# Altium project MB1363.PrjPcb (part 3 of 4)

## Sheet Ethernet.SchDoc: Ethernet PHY with RJ45 connector
size A4; Date: Not used; ApprovedBy: Not used; CheckedBy: Not used; Author: Not used; CompanyName: STMicroelectronics; DrawnBy: Not used; Engineer: Not used; Organization: Not used; Address1: Not used; Address2: Not used; Address3: Not used; Address4: Not used; DocumentNumber: 6; Revision: Not used; SheetNumber: 6; SheetTotal: 9; Time: Not used; ImagePath: Not used; Application_BuildNumber: Not used
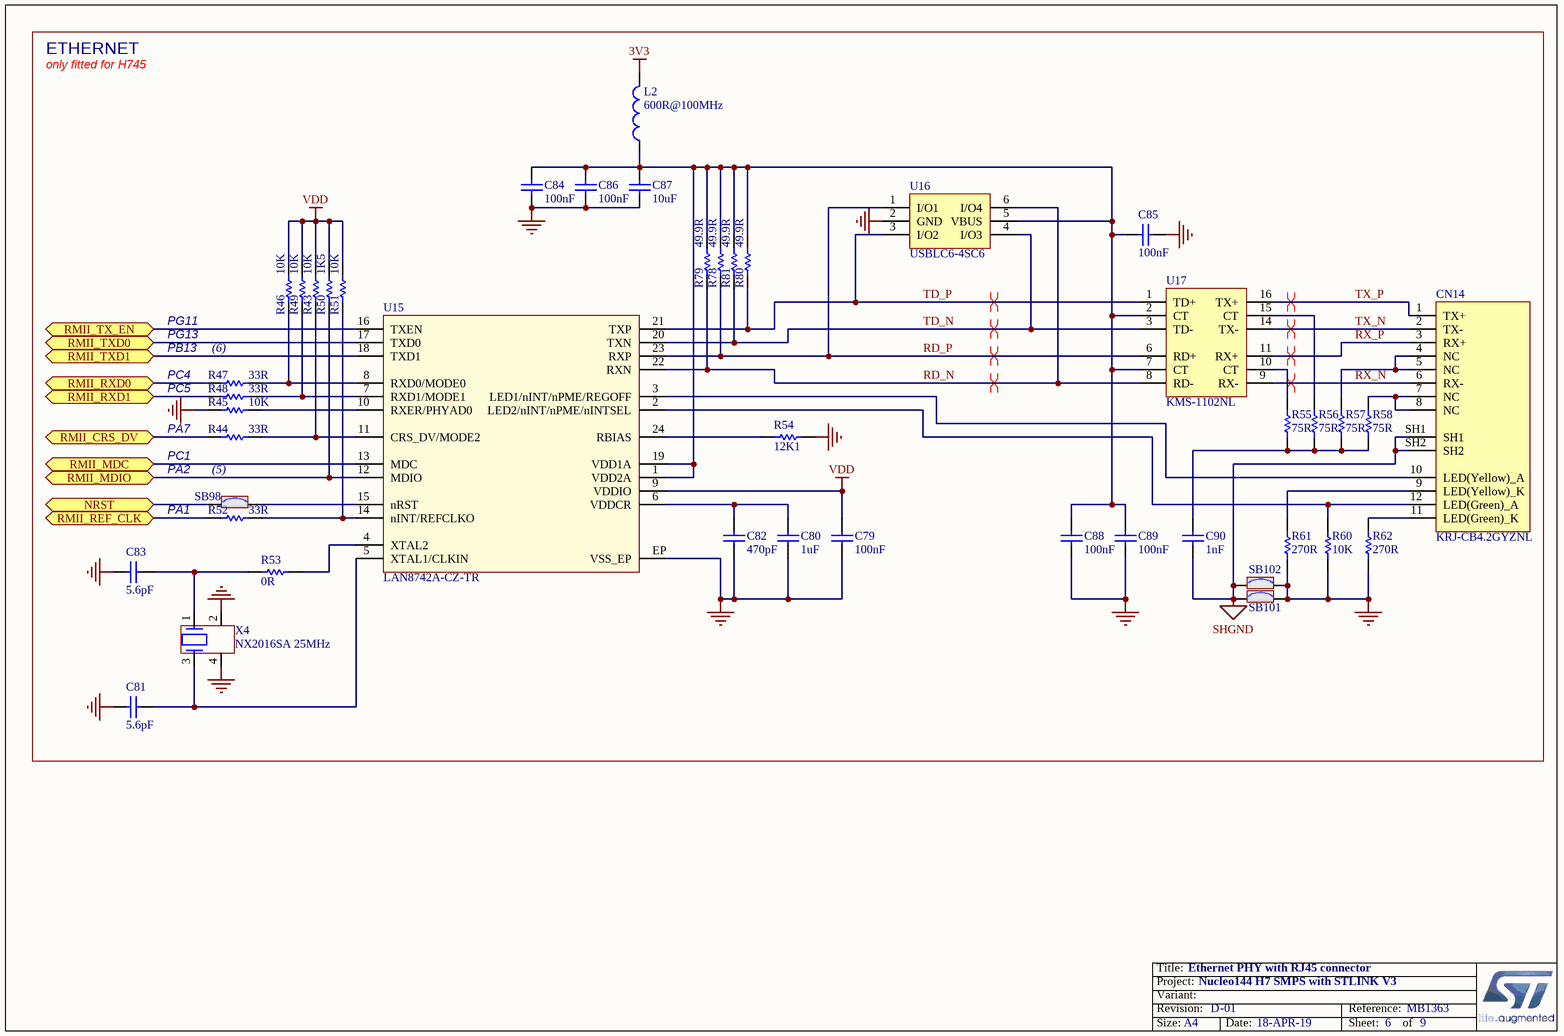
[diagram p7: Ethernet.SchDoc]

### Parts
C79  value 100nF  [C0603]  (hidden comment: Capacitor)
C80  value 1uF  [C0402]  (hidden comment: Capacitor)
C81  value 5.6pF  [C0402]  (hidden comment: Capacitor)
C82  value 470pF  [C0402]  (hidden comment: Capacitor)
C83  value 5.6pF  [C0402]  (hidden comment: Capacitor)
C84  value 100nF  [C0603]  (hidden comment: Capacitor)
C85  value 100nF  [C0603]  (hidden comment: Capacitor)
C86  value 100nF  [C0603]  (hidden comment: Capacitor)
C87  value 10uF  [C0603]  (hidden comment: Capacitor)
C88  value 100nF  [C0603]  (hidden comment: Capacitor)
C89  value 100nF  [C0603]  (hidden comment: Capacitor)
C90  value 1nF  [C1206_H1P6]  (hidden comment: Capacitor)
CN14  value KRJ-CB4.2GYZNL  [CON_RJ45_DGKYD_KRJ-CB4.2GYZNL]  (hidden comment: RJ45_KRJ-CB4.2GYZNL)
L2  value 600R@100MHz  [L0603]  (hidden comment: BEAD)
R43  value 10K  [R0402]  (hidden comment: Resistor)
R44  value 33R  [R0402]  (hidden comment: Resistor)
R45  value 10K  [R0402]  (hidden comment: Resistor)
R46  value 10K  [R0402]  (hidden comment: Resistor)
R47  value 33R  [R0402]  (hidden comment: Resistor)
R48  value 33R  [R0402]  (hidden comment: Resistor)
R49  value 10K  [R0402]  (hidden comment: Resistor)
R50  value 1K5  [R0402]  (hidden comment: Resistor)
R51  value 10K  [R0402]  (hidden comment: Resistor)
R52  value 33R  [R0402]  (hidden comment: Resistor)
R53  value 0R  [R0402]  (hidden comment: Resistor)
R54  value 12K1  [R0402]  (hidden comment: Resistor)
R55  value 75R  [R0402]  (hidden comment: Resistor)
R56  value 75R  [R0402]  (hidden comment: Resistor)
R57  value 75R  [R0402]  (hidden comment: Resistor)
R58  value 75R  [R0402]  (hidden comment: Resistor)
R60  value 10K  [R0402]  (hidden comment: Resistor)
R61  value 270R  [R0402]  (hidden comment: Resistor)
R62  value 270R  [R0402]  (hidden comment: Resistor)
R78  value 49.9R  [R0402]  (hidden comment: Resistor)
R79  value 49.9R  [R0402]  (hidden comment: Resistor)
R80  value 49.9R  [R0402]  (hidden comment: Resistor)
R81  value 49.9R  [R0402]  (hidden comment: Resistor)
SB98  SB_ON  [SOLDER-BRIDGE_R0603-0R]  (value not drawn)
SB101  SB_ON  [SOLDER-BRIDGE_R0603-0R]  (value not drawn)
SB102  SB_ON  [SOLDER-BRIDGE_R0603-0R]  (value not drawn)
U15  LAN8742A-CZ-TR  [ICC_VQFN24-EPAD_4X4_P050]
U16  USBLC6-4SC6  [ESD_SOT23-6L]
U17  KMS-1102NL  [TRS_DGKYD_KMS-1102NL]
X4  value NX2016SA 25MHz  [CRY_NX2016SA_4P]  (hidden comment: XTAL_4_PINS)

### Ports
NRST (bidir), RMII_CRS_DV (bidir), RMII_MDC (bidir), RMII_MDIO (bidir), RMII_REF_CLK (bidir), RMII_RXD0 (bidir), RMII_RXD1 (bidir), RMII_TX_EN (bidir), RMII_TXD0 (bidir), RMII_TXD1 (bidir)

### Nets
3V3: L2.2
GND: C79.1 C80.1 C81.1 C82.1 C83.1 C84.1 C85.2 C86.1 C87.1 C88.1 C89.1 R45.2 R54.2 R60.1 R61.1 R62.1 SB101.2 SB102.2 U15.EP(VSS_EP) U16.2(GND) X4.2 X4.4
SHGND: C90.1 CN14.SH1 CN14.SH2 SB101.1 SB102.1
VDD: C79.2 R43.2 R46.2 R49.2 R50.2 R51.2 U15.9(VDDIO)
NRST: SB98.1 ; port NRST
RD_N: R79.1 U15.22(RXN) U16.6(I/O4) U17.8(RD-)
RD_P: R78.1 U15.23(RXP) U16.1(I/O1) U17.6(RD+)
RMII_CRS_DV: R44.1 ; port RMII_CRS_DV
RMII_MDC: U15.13(MDC) ; port RMII_MDC
RMII_MDIO: R50.1 U15.12(MDIO) ; port RMII_MDIO
RMII_REF_CLK: R52.1 ; port RMII_REF_CLK
RMII_RXD0: R47.1 ; port RMII_RXD0
RMII_RXD1: R48.1 ; port RMII_RXD1
RMII_TX_EN: U15.16(TXEN) ; port RMII_TX_EN
RMII_TXD0: U15.17(TXD0) ; port RMII_TXD0
RMII_TXD1: U15.18(TXD1) ; port RMII_TXD1
RX_N: CN14.6(RX-) U17.9(RX-)
RX_P: CN14.3(RX+) U17.11(RX+)
TD_N: R81.1 U15.20(TXN) U16.4(I/O3) U17.3(TD-)
TD_P: R80.1 U15.21(TXP) U16.3(I/O2) U17.1(TD+)
TX_N: CN14.2(TX-) U17.14(TX-)
TX_P: CN14.1(TX+) U17.16(TX+)
NetC80_2: C80.2 C82.2 U15.6(VDDCR)
NetC81_2: C81.2 U15.5(XTAL1/CLKIN) X4.3
NetC83_2: C83.2 R53.1 X4.1
NetC84_2: C84.2 C85.1 C86.2 C87.2 C88.2 C89.2 L2.1 R78.2 R79.2 R80.2 R81.2 U15.1(VDD2A) U15.19(VDD1A) U16.5(VBUS) U17.2(CT) U17.7(CT)
NetC90_2: C90.2 R55.1 R56.1 R57.1 R58.1
NetCN14_4: CN14.4(NC) CN14.5(NC) R57.2
NetCN14_7: CN14.7(NC) CN14.8(NC) R58.2
NetCN14_9: CN14.9(LED(Yellow)_K) R61.2
NetCN14_10: CN14.10(LED(Yellow)_A) U15.3(LED1/nINT/nPME/REGOFF)
NetCN14_11: CN14.11(LED(Green)_K) R62.2
NetCN14_12: CN14.12(LED(Green)_A) R60.2 U15.2(LED2/nINT/nPME/nINTSEL)
NetR43_1: R43.1 R44.2 U15.11(CRS_DV/MODE2)
NetR45_1: R45.1 U15.10(RXER/PHYAD0)
NetR46_1: R46.1 R47.2 U15.8(RXD0/MODE0)
NetR48_2: R48.2 R49.1 U15.7(RXD1/MODE1)
NetR51_1: R51.1 R52.2 U15.14(nINT/REFCLKO)
NetR53_2: R53.2 U15.4(XTAL2)
NetR54_1: R54.1 U15.24(RBIAS)
NetR55_2: R55.2 U17.10(CT)
NetR56_2: R56.2 U17.15(CT)
NetSB98_2: SB98.2 U15.15(nRST)

### Layout directives
differential pair: RD_N, RD_P, RX_N, RX_P, TD_N, TD_P, TX_N, TX_P

### Notes on the sheet
- ETHERNET
- only fitted for H745
- PG11
- PG13
- PB13
- PC4
- (6)
- PC5
- PA7
- PC1
- PA2
- PA1
- (5)
- Title:
- Project:
- Size:
- Revision:
- Variant:
- A4
- -
- Date:
- Reference:
- Sheet:
- of

### Library data of the parts
C79 C84-C86 C88 C89 = MCD-00237: Capacitor, MLCC, 100nF, 6V3, X5R, 10%, 0603, T=0,8mm; Manufacturer_Part_Number: CC0603KRX5R5BB104; Manufacturer: YAGEO; Provided_By: SUBCO; ECCN_US: EAR99; ECCN_EU: NEC; Internal_Part_Number: MCD-00237; Status: Released; Part_Type: Capacitor; Package: C0603; ComponentLink1Description: Datasheet; ComponentLink1URL: http://tunmcdsvn.tun.st.com/Component_Datasheet_Library/Trunk/Capacitors/Yageo_Multilayer_capacitor_X5R_series_100pF_to_100uF
C80 = MCD-00095: Capacitor, MLCC, 1uF, 6V3, X5R, 10%, 0402, T=0,5mm; Manufacturer_Part_Number: GRM155R61E105KA12; Manufacturer: MURATA; Alternate_Manufacturer_Part_Number: GRM155R60J105KE19; Provided_By: SUBCO; ECCN_US: EAR99; ECCN_EU: NEC; Internal_Part_Number: MCD-00095; Status: Released; Part_Type: Capacitor; Package: C0402; ComponentLink1Description: Datasheet; ComponentLink1URL: http://tunmcdsvn.tun.st.com/Component_Datasheet_Library/Trunk/Capacitors/Murata_Capacitor_GR_series; Alternate_Manufacturer: MURATA
C81 C83 = MCD-01374: Capacitor, MLCC, 5.6pF, 50V, NPO, 5%, 0402, T=0,5mm; Manufacturer_Part_Number: CC0402BRNPO9BN5R6; Manufacturer: YAGEO; Provided_By: SUBCO; Internal_Part_Number: MCD-01374; Status: Released; Part_Type: Capacitor; Package: C0402; ComponentLink1Description: Datasheet; ComponentLink1URL: http://tunmcdsvn.tun.st.com/Component_Datasheet_Library/Trunk/Capacitors/Yageo_Capacitor_NP0_16V-to-50V; ECCN_US: N/A; ECCN_EU: N/A
C82 = MCD-00724: Capacitor, MLCC, 470pF, 50V, NPO, 5%, 0402, T=0,5mm; Manufacturer_Part_Number: CC0402JRNPO9BN471; Manufacturer: YAGEO; Provided_By: SUBCO; Internal_Part_Number: MCD-00724; Status: Released; Part_Type: Capacitor; Package: C0402; ComponentLink1Description: Datasheet; ComponentLink1URL: http://tunmcdsvn.tun.st.com/Component_Datasheet_Library/Trunk/Capacitors/Yageo_Capacitor_NP0_16V-to-50V; ECCN_US: N/A; ECCN_EU: N/A
C87 = MCD-01124: Capacitor, MLCC, 10µF, 10V, X5R, 10%, 0603, T=0.8mm; Manufacturer_Part_Number: GRM188R61A106KAAL; Manufacturer: MURATA; Provided_By: SUBCO; ECCN_US: EAR99; ECCN_EU: NEC; Internal_Part_Number: MCD-01124; Status: Released; Part_Type: Capacitor; Package: C0603; ComponentLink1Description: Datasheet; ComponentLink1URL: http://tunmcdsvn.tun.st.com/Component_Datasheet_Library/Trunk/Capacitors/Murata_Capacitor_GR_series
C90 = MCD-00722: Capacitor, MLCC, 1nF, 2KV, X7R, 10%, 1206, T=1,25mm; Manufacturer_Part_Number: CC1206KKX7RDBB102; Manufacturer: YAGEO; Provided_By: SUBCO; Internal_Part_Number: MCD-00722; Status: Released; Part_Type: Capacitor; Package: C1206; ComponentLink1Description: Datasheet; ComponentLink1URL: http://tunmcdsvn.tun.st.com/Component_Datasheet_Library/Trunk/Capacitors/Yageo_Multilayer_Capacitor_NPO_X7R_1KV_to_3KV_10pF_to_33nF/; ECCN_US: N/A; ECCN_EU: N/A
CN14 = MCD-00717: RJ45 jack, single port, with LEDS, Metal shielded dip low profile; Part_Type: Connector; Manufacturer: DONGGUAN KEYOUDA ELECTRONIC TECHNOLOGY; Provided_By: SUBCO; Internal_Part_Number: MCD-00717; Status: Released; Manufacturer_Part_Number: KRJ-CB4.2GYZNL; ComponentLink1Description: Datasheet; ComponentLink1URL: http://tunmcdsvn.tun.st.com/Component_Datasheet_Library/Trunk/Connectors/DGKYD_RJ45_KRJ-CB4.2GYZNL; ECCN_US: n/a; ECCN_EU: n/a
L2 = MCD-00047: SMD Chip ferrite bead, 600R@100MHz +/-25%, 350mA, 500mohm DC, 0603, T=0.8mm; Part_Type: Inductor; Manufacturer_Part_Number: FCM1608KF-601T03; Manufacturer: TAI-TECH; Provided_By: SUBCO; Internal_Part_Number: MCD-00047; Status: Released; ComponentLink1Description: Datasheet; ComponentLink1URL: http://tunmcdsvn.tun.st.com/Component_Datasheet_Library/Trunk/Inductors/TaiTech_Bead_FCM1608_series; ECCN_US: n/a; ECCN_EU: n/a
R43 R45 R46 R49 R51 R60 = MCD-00053: Resistor,10K,0402,1%,1/16W; Manufacturer_Part_Number: RC0402FR-0710KL; Manufacturer: YAGEO; Provided_By: SUBCO; ECCN_US: EAR99; ECCN_EU: NEC; Internal_Part_Number: MCD-00053; Status: Released; Part_Type: Resistor; Package: R0402; ComponentLink1Description: Datasheet; ComponentLink1URL: http://tunmcdsvn.tun.st.com/Component_Datasheet_Library/Trunk/Resistors/Yageo_Resistor_RC0402-series
R44 R47 R48 R52 = MCD-00455: Resistor,33R,0402,1%,1/16W; Manufacturer_Part_Number: RC0402FR-0733RL; Manufacturer: YAGEO; Provided_By: SUBCO; ECCN_US: EAR99; ECCN_EU: NEC; Internal_Part_Number: MCD-00455; Status: Released; Part_Type: Resistor; Package: R0402; ComponentLink1Description: Datasheet; ComponentLink1URL: http://tunmcdsvn.tun.st.com/Component_Datasheet_Library/Trunk/Resistors/Yageo_Resistor_RC0402-series
R50 = MCD-00068: Resistor,1K5,0402,1%,1/16W; Manufacturer_Part_Number: RC0402FR-071K5L; Manufacturer: YAGEO; Provided_By: SUBCO; ECCN_US: EAR99; ECCN_EU: NEC; Internal_Part_Number: MCD-00068; Status: Released; Part_Type: Resistor; Package: R0402; ComponentLink1Description: Datasheet; ComponentLink1URL: http://tunmcdsvn.tun.st.com/Component_Datasheet_Library/Trunk/Resistors/Yageo_Resistor_RC0402-series
R53 = MCD-00052: Resistor,0R,0402,5%,1/16W; Manufacturer_Part_Number: RC0402JR-070RL; Manufacturer: YAGEO; Provided_By: SUBCO; ECCN_US: EAR99; ECCN_EU: NEC; Internal_Part_Number: MCD-00052; Status: Released; Part_Type: Resistor; Package: R0402; ComponentLink1Description: Datasheet; ComponentLink1URL: http://tunmcdsvn.tun.st.com/Component_Datasheet_Library/Trunk/Resistors/Yageo_Resistor_RC0402-series
R54 = MCD-00723: Resistor,12K1,0402,1%,1/16W; Manufacturer_Part_Number: RC0402FR-0712K1L; Manufacturer: YAGEO; Provided_By: SUBCO; ECCN_US: EAR99; ECCN_EU: NEC; Internal_Part_Number: MCD-00723; Status: Released; Part_Type: Resistor; Package: R0402; ComponentLink1Description: Datasheet; ComponentLink1URL: http://tunmcdsvn.tun.st.com/Component_Datasheet_Library/Trunk/Resistors/Yageo_Resistor_RC0402-series
R55-R58 = MCD-00515: Resistor,75R,0402,1%,1/16W; Manufacturer_Part_Number: RC0402FR-0775RL; Manufacturer: YAGEO; Provided_By: SUBCO; ECCN_US: EAR99; ECCN_EU: NEC; Internal_Part_Number: MCD-00515; Status: Released; Part_Type: Resistor; Package: R0402; ComponentLink1Description: Datasheet; ComponentLink1URL: http://tunmcdsvn.tun.st.com/Component_Datasheet_Library/Trunk/Resistors/Yageo_Resistor_RC0402-series
R61 R62 = MCD-00441: Resistor,270R,0402,1%,1/16W; Manufacturer_Part_Number: RC0402FR-07270RL; Manufacturer: YAGEO; Provided_By: SUBCO; ECCN_US: EAR99; ECCN_EU: NEC; Internal_Part_Number: MCD-00441; Status: Released; Part_Type: Resistor; Package: R0402; ComponentLink1Description: Datasheet; ComponentLink1URL: http://tunmcdsvn.tun.st.com/Component_Datasheet_Library/Trunk/Resistors/Yageo_Resistor_RC0402-series
R78-R81 = MCD-00565: Resistor,49R9,0402,1%,1/16W; Manufacturer_Part_Number: RC0402FR-0749R9L; Manufacturer: YAGEO; Provided_By: SUBCO; ECCN_US: EAR99; ECCN_EU: NEC; Internal_Part_Number: MCD-00565; Status: Released; Part_Type: Resistor; Package: R0402; ComponentLink1Description: Datasheet; ComponentLink1URL: http://tunmcdsvn.tun.st.com/Component_Datasheet_Library/Trunk/Resistors/Yageo_Resistor_RC0402-series
SB98 SB101 SB102 = MCD-00071: Solder Bridge ON; Part_Type: Mechanical; Manufacturer_Part_Number: RC0603JR-070RL; Manufacturer: YAGEO; Provided_By: SUBCO; Internal_Part_Number: MCD-00071; Status: Released; ComponentLink1Description: Datasheet; Package: SB0603; ComponentLink1URL: http://tunmcdsvn.tun.st.com/Component_Datasheet_Library/Trunk/Resistors/Yageo_Resistor_RC0603-series; ECCN_US: n/a; ECCN_EU: n/a
U15 = MCD-00719: 10/100M RMII Ethernet transceiver; Part_Type: IC; Manufacturer: MICROCHIP; Provided_By: SUBCO; Internal_Part_Number: MCD-00719; Value: LAN8742A-CZ-TR; Status: Released; Manufacturer_Part_Number: LAN8742A-CZ-TR; ComponentLink1Description: Datasheet; ComponentLink1URL: http://tunmcdsvn.tun.st.com/Component_Datasheet_Library/Trunk/IC/MICROCHIP_LAN8742A_RMII_PHY; ECCN_US: n/a; ECCN_EU: n/a
U16 = MCD-00250: Very low capacitance ESD protection , 4 lines; Part_Type: IC; Manufacturer: STMICROELECTRONICS; BMS_Part_Number: 9151001; Provided_By: SUBCO with ST control; ECCN_US: EAR99; ECCN_EU: NEC; Internal_Part_Number: MCD-00250; Value: USBLC6-4SC6; Status: Released; Manufacturer_Part_Number: USBLC6-4SC6; ComponentLink1Description: Datasheet; ComponentLink1URL: http://tunmcdsvn.tun.st.com/Component_Datasheet_Library/Trunk/Diodes/STM_ESD_USBLC6-4SC6
U17 = MCD-00718: Discrete Magnetic Transformer Module, 16 pins, SMT, 100 Base-TX; Part_Type: IC; Manufacturer: DONGGUAN KEYOUDA ELECTRONIC TECHNOLOGY; Provided_By: SUBCO; Internal_Part_Number: MCD-00718; Value: KMS-1102NL; Status: Released; Manufacturer_Part_Number: KMS-1102NL; ComponentLink1Description: Datasheet; ComponentLink1URL: http://tunmcdsvn.tun.st.com/Component_Datasheet_Library/Trunk/IC/DGKYD_KMS-1102NL; ECCN_US: n/a; ECCN_EU: n/a
X4 = MCD-01364: Crystal 25MHz, 6pF, +-20ppm, 80ohms max, SMD; Part_Type: Crystal_Osc; Manufacturer_Part_Number: NX2016SA 25MHz EXS00A-CS11321; Manufacturer: NDK; BMS_Part_Number: 9157044; Provided_By: SUBCO; ECCN_US: EAR99; ECCN_EU: NEC; Internal_Part_Number: MCD-01364; Status: Released; Package: NX2016SA; ComponentLink1Description: Datasheet; ComponentLink1URL: http://tunmcdsvn.tun.st.com/Component_Datasheet_Library/Trunk/Crystal_Osc/NDK_NX2016SA 25MHz EXS00A-CS11321 (EXS10B-28187); Order_Code_Digikey: 644-1367

## Sheet ST_LINK_V3E.SchDoc: STLINK_V3E
size A3; Date: Not used; ApprovedBy: Not used; CheckedBy: Not used; Author: Not used; CompanyName: STMicroelectronics; DrawnBy: Not used; Engineer: Not used; Organization: Not used; Address1: Not used; Address2: Not used; Address3: Not used; Address4: Not used; DocumentNumber: 10; Revision: Not used; SheetNumber: 9; SheetTotal: 9; CurrentTime: Not used; CurrentDate: Not used; Time: Not used; DocumentFullPathAndName: Not used; DocumentName: Not used; ModifiedDate: Not used; ImagePath: Not used; ProjectName: Not used; Application_BuildNumber: Not used
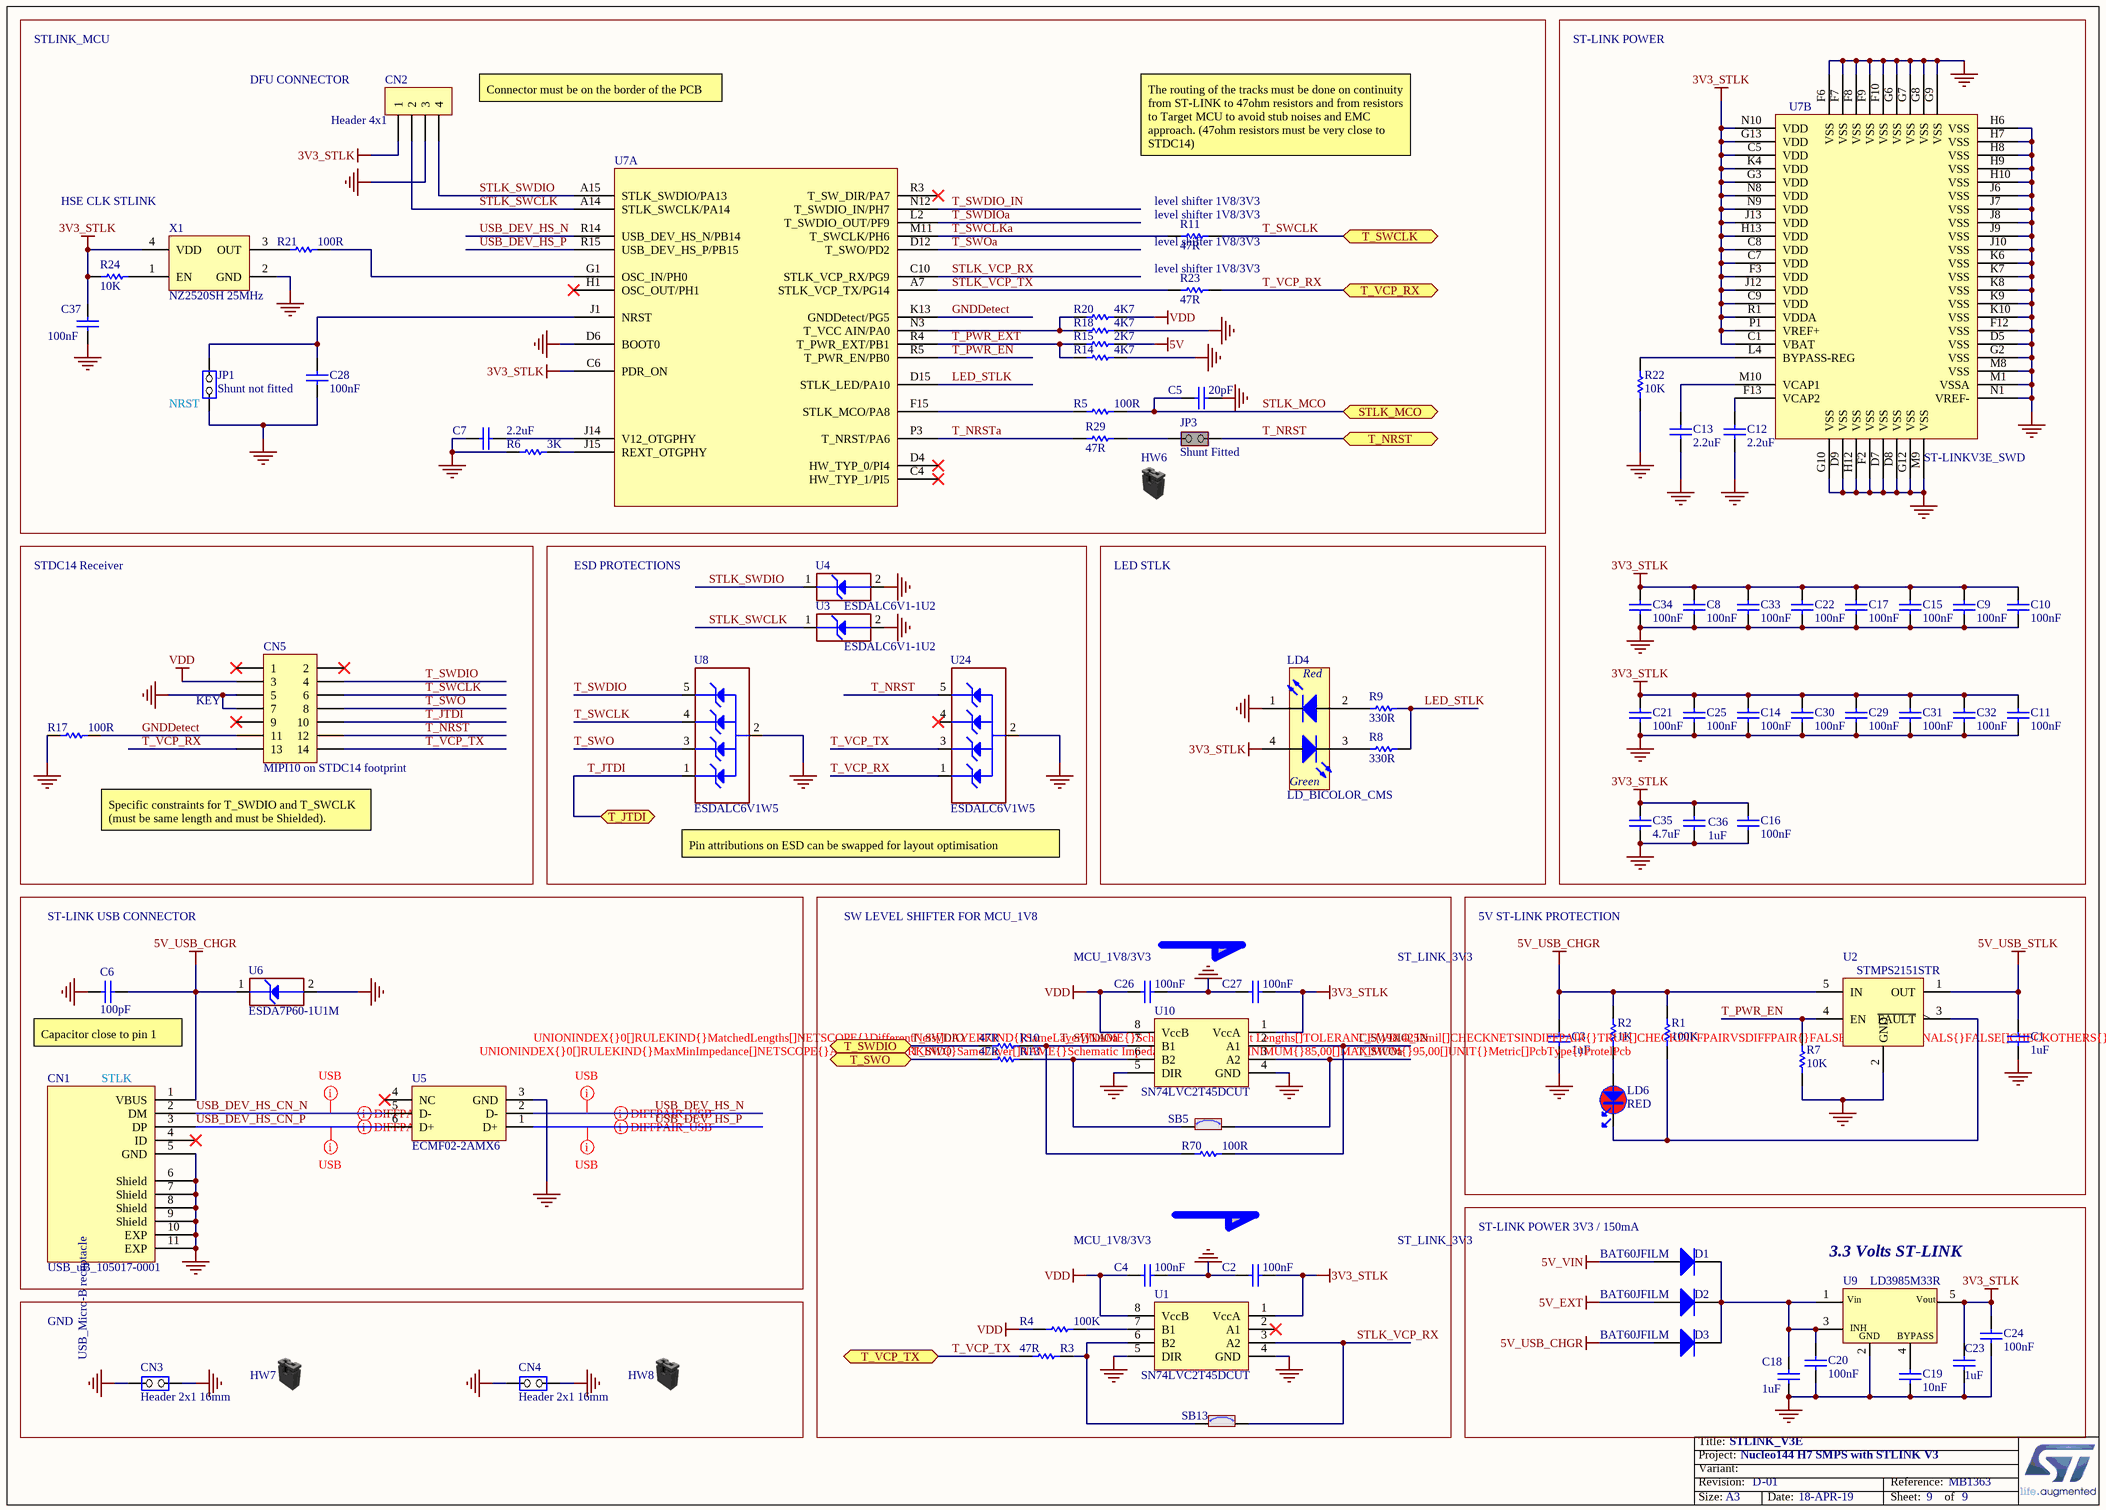
[diagram p8: ST_LINK_V3E.SchDoc]

### Parts
C1  value 1uF  [C0603]  (hidden comment: Capacitor)
C2  value 100nF  [C0603]  (hidden comment: Capacitor)
C3  value 1uF  [C0603]  (hidden comment: Capacitor)
C4  value 100nF  [C0603]  (hidden comment: Capacitor)
C5  value 20pF  [C0402]  (hidden comment: Capacitor)
C6  value 100pF  [C0402]  (hidden comment: Capacitor)
C7  value 2.2uF  [C0603]  (hidden comment: Capacitor)
C8  value 100nF  [C0402]  (hidden comment: Capacitor)
C9  value 100nF  [C0402]  (hidden comment: Capacitor)
C10  value 100nF  [C0402]  (hidden comment: Capacitor)
C11  value 100nF  [C0402]  (hidden comment: Capacitor)
C12  value 2.2uF  [C0603]  (hidden comment: Capacitor)
C13  value 2.2uF  [C0603]  (hidden comment: Capacitor)
C14  value 100nF  [C0402]  (hidden comment: Capacitor)
C15  value 100nF  [C0402]  (hidden comment: Capacitor)
C16  value 100nF  [C0402]  (hidden comment: Capacitor)
C17  value 100nF  [C0402]  (hidden comment: Capacitor)
C18  value 1uF  [C0603]  (hidden comment: Capacitor)
C19  value 10nF  [C0402]  (hidden comment: Capacitor)
C20  value 100nF  [C0402]  (hidden comment: Capacitor)
C21  value 100nF  [C0402]  (hidden comment: Capacitor)
C22  value 100nF  [C0402]  (hidden comment: Capacitor)
C23  value 1uF  [C0603]  (hidden comment: Capacitor)
C24  value 100nF  [C0402]  (hidden comment: Capacitor)
C25  value 100nF  [C0402]  (hidden comment: Capacitor)
C26  value 100nF  [C0603]  (hidden comment: Capacitor)
C27  value 100nF  [C0603]  (hidden comment: Capacitor)
C28  value 100nF  [C0402]  (hidden comment: Capacitor)
C29  value 100nF  [C0402]  (hidden comment: Capacitor)
C30  value 100nF  [C0402]  (hidden comment: Capacitor)
C31  value 100nF  [C0402]  (hidden comment: Capacitor)
C32  value 100nF  [C0402]  (hidden comment: Capacitor)
C33  value 100nF  [C0402]  (hidden comment: Capacitor)
C34  value 100nF  [C0402]  (hidden comment: Capacitor)
C35  value 4.7uF  [C0603]  (hidden comment: Capacitor)
C36  value 1uF  [C0603]  (hidden comment: Capacitor)
C37  value 100nF  [C0402]  (hidden comment: Capacitor)
CN1  value USB_uB_105017-0001  [CON_USBMICROB_MOLEX_105017-0001_H2P90]  (hidden comment: USB_uB_105017.0001)
CN2  Header 4x1  [CON_SAMTEC_TSW-104-07-G-S]
CN3  value Header 2x1 16mm  [CON_SAMTEC_TSW-102-09-X-S]  (hidden comment: Jumper_Header 2x1)
CN4  value Header 2x1 16mm  [CON_SAMTEC_TSW-102-09-X-S]  (hidden comment: Jumper_Header 2x1)
CN5  value MIPI10 on STDC14 footprint  [CON_STDC14_Receiver_MEDIUM_WITH_MIPI10_3D]  (hidden comment: Header 7x2)
D1  BAT60JFILM  [DIO_SOD323]
D2  BAT60JFILM  [DIO_SOD323]
D3  BAT60JFILM  [DIO_SOD323]
HW6  Shunt Black 2.54mm  (value not drawn)  (mechanical)
HW7  Shunt Black 2.54mm  (value not drawn)  (mechanical)
HW8  Shunt Black 2.54mm  (value not drawn)  (mechanical)
JP1  value Shunt not fitted  [CON_SAMTEC_TSW-102-07-G-S]  (hidden comment: Jumper_Header 2x1)
JP3  value Shunt Fitted  [CON_SAMTEC_TSW-102-07-G-S]  (hidden comment: Jumper_Header 2x1 Fitted)
LD4  LD_BICOLOR_CMS  [LED_BI-GR_HSMF-A201-A00J1]
LD6  value RED  [LED_0603_RED]  (hidden comment: LED_red)
R1  value 100K  [R0603]  (hidden comment: Resistor)
R2  value 1K  [R0603]  (hidden comment: Resistor)
R3  value 47R  [R0402]  (hidden comment: Resistor)
R4  value 100K  [R0603]  (hidden comment: Resistor)
R5  value 100R  [R0402]  (hidden comment: Resistor)
R6  value 3K  [R0402]  (hidden comment: Resistor)
R7  value 10K  [R0603]  (hidden comment: Resistor)
R8  value 330R  [R0603]  (hidden comment: Resistor)
R9  value 330R  [R0603]  (hidden comment: Resistor)
R10  value 47R  [R0402]  (hidden comment: Resistor)
R11  value 47R  [R0402]  (hidden comment: Resistor)
R13  value 47R  [R0402]  (hidden comment: Resistor)
R14  value 4K7  [R0402]  (hidden comment: Resistor)
R15  value 2K7  [R0402]  (hidden comment: Resistor)
R17  value 100R  [R0402]  (hidden comment: Resistor)
R18  value 4K7  [R0402]  (hidden comment: Resistor)
R20  value 4K7  [R0402]  (hidden comment: Resistor)
R21  value 100R  [R0402]  (hidden comment: Resistor)
R22  value 10K  [R0402]  (hidden comment: Resistor)
R23  value 47R  [R0402]  (hidden comment: Resistor)
R24  value 10K  [R0402]  (hidden comment: Resistor)
R29  value 47R  [R0402]  (hidden comment: Resistor)
R70  value 100R  [R0402]  (hidden comment: Resistor)
SB5  SB_ON  [SOLDER-BRIDGE_R0603-0R]  (value not drawn)
SB13  SB_ON  [SOLDER-BRIDGE_R0603-0R]  (value not drawn)
U1  SN74LVC2T45DCUT  [ICC_VSSOP8_DCU_R-PDSO-G8_2X2P30_P050]
U2  STMPS2151STR  [MOS_SOT23-5L]
U3  value ESDALC6V1-1U2  [ESD_ST0201]  (hidden comment: ESD-TRANSIL)
U4  value ESDALC6V1-1U2  [ESD_ST0201]  (hidden comment: ESD-TRANSIL)
U5  ECMF02-2AMX6  [ESD_QFN-6L_1P7X1P5_P050]
U6  value ESDA7P60-1U1M  [ESD_QFN2_1P6X1_P125]  (hidden comment: ESD-TRANSIL)
U7  ST-LINKV3E_SWD  [ICC_UFBGA201_176+25_10X10_P065]  (parts A,B of 2)
U8  ESDALC6V1W5  [ESD_SOT323-5L]
U9  LD3985M33R  [REG_SOT23-5L]
U10  SN74LVC2T45DCUT  [ICC_VSSOP8_DCU_R-PDSO-G8_2X2P30_P050]
U24  ESDALC6V1W5  [ESD_SOT323-5L]
X1  value NZ2520SH 25MHz  [OSC_NDK_NZ2520SB_4P]  (hidden comment: OSCILLATOR_4_PINS)

### Blocks framed on the sheet
ST-LINK POWER: C8-C17 C21 C22 C25 C29-C36 R22 U7
ESD PROTECTIONS: U3 U4 U8 U24
LED STLK: LD4 R8 R9
5V ST-LINK PROTECTION: C1 C3 LD6 R1 R2 R7 U2
3.3 Volts ST-LINK: C18-C20 C23 C24 D1-D3 U9
GND: CN3 CN4 HW7 HW8

### Ports
STLK_MCO, T_JTDI (bidir), T_NRST, T_SWCLK, T_SWDIO, T_SWO, T_VCP_RX, T_VCP_TX

### Nets
3V3_STLK: C2.2 C8.2 C9.2 C10.2 C11.2 C14.2 C15.2 C16.2 C17.2 C21.2 C22.2 C23.2 C24.2 C25.2 C27.2 C29.2 C30.2 C31.2 C32.2 C33.2 C34.2 C35.2 C36.2 C37.2 CN2.1 LD4.4(YellowGreen_anode) R24.1 U1.1(VccA) U7.C1(VBAT) U7.C5(VDD) U7.C6(PDR_ON) U7.C7(VDD) U7.C8(VDD) U7.C9(VDD) U7.F3(VDD) U7.G3(VDD) U7.G13(VDD) U7.H13(VDD) U7.J12(VDD) U7.J13(VDD) U7.K4(VDD) U7.N8(VDD) U7.N9(VDD) U7.N10(VDD) U7.P1(VREF+) U7.R1(VDDA) U9.5(Vout) U10.1(VccA) X1.4(VDD)
5V: R15.1
5V_EXT: D2.1(A)
5V_USB_CHGR: C3.2 C6.2 CN1.1(VBUS) D3.1(A) R1.2 R2.2 U2.5(IN) U6.1(IO1)
5V_USB_STLK: C1.2 U2.1(OUT)
5V_VIN: D1.1(A)
GND: C1.1 C2.1 C3.1 C4.2 C5.1 C6.1 C7.1 C8.1 C9.1 C10.1 C11.1 C12.1 C13.1 C14.1 C15.1 C16.1 C17.1 C18.2 C19.1 C20.1 C21.1 C22.1 C23.1 C24.1 C25.1 C26.2 C27.1 C28.1 C29.1 C30.1 C31.1 C32.1 C33.1 C34.1 C35.1 C36.1 C37.1 CN1.5(GND) CN1.6(Shield) CN1.7(Shield) CN1.8(Shield) CN1.9(Shield) CN1.10(EXP) CN1.11(EXP) CN2.3 CN3.1(COMMON) CN3.2(NO) CN4.1(COMMON) CN4.2(NO) CN5.5 CN5.7 JP1.1(COMMON) LD4.1(RED_cathode) R6.1 R7.2 R14.1 R17.1 R18.2 R22.1 U1.4(GND) U1.5(DIR) U2.2(GND) U3.2(GND) U4.2(GND) U5.3(GND) U6.2(GND) U7.D5(VSS) U7.D6(BOOT0) U7.D7(VSS) U7.D8(VSS) U7.D9(VSS) U7.F2(VSS) U7.F6(VSS) U7.F7(VSS) U7.F8(VSS) U7.F9(VSS) U7.F10(VSS) U7.F12(VSS) U7.G2(VSS) U7.G6(VSS) U7.G7(VSS) U7.G8(VSS) U7.G9(VSS) U7.G10(VSS) U7.G12(VSS) U7.H6(VSS) U7.H7(VSS) U7.H8(VSS) U7.H9(VSS) U7.H10(VSS) U7.H12(VSS) U7.J6(VSS) U7.J7(VSS) U7.J8(VSS) U7.J9(VSS) U7.J10(VSS) U7.K6(VSS) U7.K7(VSS) U7.K8(VSS) U7.K9(VSS) U7.K10(VSS) U7.M1(VSSA) U7.M8(VSS) U7.M9(VSS) U7.N1(VREF-) U8.2(GND) U9.2(GND) U10.4(GND) U10.5(DIR) U24.2(GND) X1.2(GND)
VDD: C4.1 C26.1 CN5.3 R4.2 R20.2 U1.8(VccB) U10.8(VccB)
GNDDetect: CN5.11 R17.2 U7.K13(GNDDetect/PG5)
LED_STLK: R8.2 R9.2 U7.D15(STLK_LED/PA10)
STLK_MCO: C5.2 R5.2 ; port STLK_MCO
STLK_SWCLK: CN2.2 U3.1(IO1) U7.A14(STLK_SWCLK/PA14)
STLK_SWDIO: CN2.4 U4.1(IO1) U7.A15(STLK_SWDIO/PA13)
STLK_VCP_RX: SB13.1 U1.3(A2) U7.C10(STLK_VCP_RX/PG9)
STLK_VCP_TX: R23.1 U7.A7(STLK_VCP_TX/PG14)
T_JTDI: CN5.10 U8.1(IO1) ; port T_JTDI  [project net PA15]
T_NRST: CN5.12 JP3.2(NO) U24.5(IO4) ; port T_NRST
T_NRSTa: R29.1 U7.P3(T_NRST/PA6)
T_PWR_EN: R7.1 U2.4(EN) U7.R5(T_PWR_EN/PB0)
T_PWR_EXT: R14.2 R15.2 U7.R4(T_PWR_EXT/PB1)
T_SWCLK: CN5.6 R11.2 U8.4(IO3) ; port T_SWCLK
T_SWCLKa: R11.1 U7.M11(T_SWCLK/PH6)
T_SWDIO: CN5.4 R10.1 U8.5(IO4) ; port T_SWDIO
T_SWDIO_IN: R70.2 U7.N12(T_SWDIO_IN/PH7) U10.2(A1)
T_SWDIOa: R10.2 R70.1 U7.L2(T_SWDIO_OUT/PF9) U10.7(B1)
T_SWO: CN5.8 R13.1 U8.3(IO2) ; port T_SWO
T_SWOa: SB5.1 U7.D12(T_SWO/PD2) U10.3(A2)
T_VCP_RX: CN5.13 R23.2 U24.1(IO1) ; port T_VCP_RX
T_VCP_TX: CN5.14 R3.1 U24.3(IO2) ; port T_VCP_TX
USB_DEV_HS_CN_N: CN1.2(DM) U5.5(D-)
USB_DEV_HS_CN_P: CN1.3(DP) U5.6(D+)
USB_DEV_HS_N: U5.2(D-) U7.R14(USB_DEV_HS_N/PB14)
USB_DEV_HS_P: U5.1(D+) U7.R15(USB_DEV_HS_P/PB15)
NetC7_2: C7.2 U7.J14(V12_OTGPHY)
NetC12_2: C12.2 U7.F13(VCAP2)
NetC13_2: C13.2 U7.M10(VCAP1)
NetC18_1: C18.1 C20.2 D1.2(K) D2.2(K) D3.2(K) U9.1(Vin) U9.3(CE)
NetC19_2: C19.2 U9.4(BYPASS)
NetC28_2: C28.2 JP1.2(NO) U7.J1(NRST)
NetJP3_1: JP3.1(COMMON) R29.2
NetLD4_2: LD4.2(Red_anode) R9.1
NetLD4_3: LD4.3(YellowGreen_cathode) R8.1
NetLD6_1: LD6.1 R2.1
NetLD6_2: LD6.2 R1.1 U2.3(~{FAULT})
NetR3_2: R3.2 SB13.2 U1.6(B2)
NetR4_1: R4.1 U1.7(B1)
NetR5_1: R5.1 U7.F15(STLK_MCO/PA8)
NetR6_2: R6.2 U7.J15(REXT_OTGPHY)
NetR13_2: R13.2 SB5.2 U10.6(B2)
NetR18_1: R18.1 R20.1 U7.N3(T_VCC_AIN/PA0)
NetR21_1: R21.1 X1.3(OUT)
NetR21_2: R21.2 U7.G1(OSC_IN/PH0)
NetR22_2: R22.2 U7.L4(BYPASS-REG)
NetR24_2: R24.2 X1.1(EN)

Not connected (* = marked no-connect by the designer): CN1 4(ID)*; CN5 1* 2* 9*; U1 2(A1)*; U5 4(NC)*; U7 C4(HW_TYP_1/PI5)* D4(HW_TYP_0/PI4)* H1(OSC_OUT/PH1)* R3(T_SW_DIR/PA7)*; U24 4(IO3)*

### Layout directives
differential pair; rule Impedance Constraint [Min = 85.00    Max = 95.00    ]: USB_DEV_HS_CN_N, USB_DEV_HS_CN_P, USB_DEV_HS_N, USB_DEV_HS_P
rule Undefined; rule Matched Net Lengths [Tolerance = 2.5mm]; rule Impedance Constraint [Min = 85.00    Max = 95.00    ]: USB_DEV_HS_N
rule Undefined; rule Matched Net Lengths [Tolerance = 0.2mm]; rule Impedance Constraint [Min = 85.00    Max = 95.00    ]: USB_DEV_HS_CN_N, USB_DEV_HS_CN_P, USB_DEV_HS_P

### Notes on the sheet
- STLINK_MCU
- DFU CONNECTOR
- (near CN2) Connector must be on the border of the PCB
- The routing of the tracks must be done on continuity from ST-LINK to 47ohm resistors and from resistors to Target MCU to avoid stub noises and EMC approach. (47ohm resistors must be very close to STDC14)
- HSE CLK STLINK
- (near R11) level shifter 1V8/3V3
- level shifter 1V8/3V3
- (near JP1) NRST
- STDC14 Receiver
- (near CN5) KEY
- Specific constraints for T_SWDIO and T_SWCLK (must be same length and must be Shielded).
- Pin attributions on ESD can be swapped for layout optimisation
- ST-LINK USB CONNECTOR
- SW LEVEL SHIFTER FOR MCU_1V8
- MCU_1V8/3V3
- ST_LINK_3V3
- (near C6) Capacitor close to pin 1
- (near CN1) STLK
- ST-LINK POWER 3V3 / 150mA
- Title:
- Project:
- Size:
- Revision:
- Variant:
- A3
- -
- Date:
- Reference:
- Sheet:
- of
- (in symbol MCD-00028) USB_Micro-B receptacle
- (in symbol MCD-00051) Red; Green
- (in symbol MCD-00086) INH

### Library data of the parts
C1 C3 C18 = MCD-00238: Capacitor, MLCC, 1uF, 6V3, X5R, 10%, 0603, T=0,8mm; Manufacturer_Part_Number: CC0603KRX5R5BB105; Manufacturer: YAGEO; Provided_By: SUBCO; ECCN_US: EAR99; ECCN_EU: NEC; Internal_Part_Number: MCD-00238; ComponentLink1Description: Datasheet; Status: Released; Part_Type: Capacitor; Package: C0603; ComponentLink1URL: http://tunmcdsvn.tun.st.com/Component_Datasheet_Library/Trunk/Capacitors/Yageo_Multilayer_capacitor_X5R_series_100pF_to_100uF
C2 C4 = MCD-00211: Capacitor, MLCC, 100nF, 16V, X7R, 10%, 0603, T=0,8mm; Manufacturer_Part_Number: CC0603KRX7R7BB104; Manufacturer: YAGEO; Provided_By: SUBCO; ECCN_US: EAR99; ECCN_EU: NEC; Internal_Part_Number: MCD-00211; Status: Released; Part_Type: Capacitor; Package: C0603; ComponentLink1Description: Datasheet; ComponentLink1URL: http://tunmcdsvn.tun.st.com/Component_Datasheet_Library/Trunk/Capacitors/Yageo_Multilayer_Capacitor_X7R_series_100pF_to_22uF
C5 = MCD-00016: Capacitor, MLCC, 20pF, 50V, NPO, 5%, 0402, T=0,5mm; Manufacturer_Part_Number: CC0402JRNPO9BN200; Manufacturer: YAGEO; Provided_By: SUBCO; ECCN_US: EAR99; ECCN_EU: NEC; Internal_Part_Number: MCD-00016; Status: Released; Package: C0402; ComponentLink1Description: Datasheet; Part_Type: Capacitor; ComponentLink1URL: http://tunmcdsvn.tun.st.com/Component_Datasheet_Library/Trunk/Capacitors/Yageo_Capacitor_NP0_16V-to-50V
C6 = MCD-00205: Capacitor, MLCC, 100pF, 50V, NPO, 5%, 0402, T=0,5mm; Manufacturer_Part_Number: CC0402JRNPO9BN101; Manufacturer: YAGEO; Provided_By: SUBCO; ECCN_US: EAR99; ECCN_EU: NEC; Internal_Part_Number: MCD-00205; Status: Released; Part_Type: Capacitor; Package: C0402; ComponentLink1Description: Datasheet; ComponentLink1URL: http://tunmcdsvn.tun.st.com/Component_Datasheet_Library/Trunk/Capacitors/Yageo_Capacitor_NP0_16V-to-50V
C7 C12 C13 = MCD-00012: Capacitor, MLCC, 2.2uF, 10V, X5R, 10%, 0603, T=0,8mm; Manufacturer_Part_Number: CC0603KRX5R6BB225; Manufacturer: YAGEO; Alternate_Manufacturer_Part_Number: C0603C225K8PACTU; Alternate_Manufacturer: KEMET; Provided_By: SUBCO; ECCN_US: EAR99; ECCN_EU: NEC; Internal_Part_Number: MCD-00012; Status: Released; Package: C0603; ComponentLink1Description: Datasheet; Part_Type: Capacitor; ComponentLink1URL: http://tunmcdsvn.tun.st.com/Component_Datasheet_Library/Trunk/Capacitors/Yageo_Multilayer_capacitor_X5R_series_100pF_to_100uF
C8-C11 C14-C17 C20-C22 C24 C25 C28-C34 C37 = MCD-00102: Capacitor, MLCC, 100nF, 16V, X7R, 10%, 0402, T=0,5mm; Manufacturer_Part_Number: CC0402KRX7R7BB104; Manufacturer: YAGEO; Alternate_Manufacturer_Part_Number: GCM155R71C104KA55D; Alternate_Manufacturer: MURATA; Provided_By: SUBCO; ECCN_US: EAR99; ECCN_EU: NEC; Internal_Part_Number: MCD-00102; Status: Released; Package: C0402; ComponentLink1Description: Datasheet; Part_Type: Capacitor; ComponentLink1URL: http://tunmcdsvn.tun.st.com/Component_Datasheet_Library/Trunk/Capacitors/Yageo_Multilayer_Capacitor_X7R_series_100pF_to_22uF
C19 = MCD-00011: Capacitor, MLCC, 10nF, 16V, X7R, 10%, 0402, T=0.5mm; Manufacturer_Part_Number: CC0402KRX7R7BB103; Manufacturer: YAGEO; Provided_By: SUBCO; ECCN_US: EAR99; ECCN_EU: NEC; Internal_Part_Number: MCD-00011; Status: Released; Part_Type: Capacitor; Package: C0402; ComponentLink1Description: Datasheet; ComponentLink1URL: http://tunmcdsvn.tun.st.com/Component_Datasheet_Library/Trunk/Capacitors/Yageo_Multilayer_Capacitor_X7R_series_100pF_to_22uF
C23 C36 = MCD-00010: Capacitor, MLCC, 1uF, 16V, X5R, 10%, 0603, T=0,8mm; Manufacturer_Part_Number: CC0603KRX5R7BB105; Manufacturer: YAGEO; Provided_By: SUBCO; ECCN_US: EAR99; ECCN_EU: NEC; Internal_Part_Number: MCD-00010; Status: Released; Package: C0603; ComponentLink1Description: Datasheet; Part_Type: Capacitor; ComponentLink1URL: http://tunmcdsvn.tun.st.com/Component_Datasheet_Library/Trunk/Capacitors/Yageo_Multilayer_capacitor_X5R_series_100pF_to_100uF
C26 C27 = MCD-00237: as C79 on sheet Ethernet; Internal_Part_Number: MCD-00237; ComponentLink1Description: Datasheet; Status: Released; Part_Type: Capacitor; Package: C0603; ComponentLink1URL: http://tunmcdsvn.tun.st.com/Component_Datasheet_Library/Trunk/Capacitors/Yageo_Multilayer_capacitor_X5R_series_100pF_to_100uF
C35 = MCD-00009: Capacitor, MLCC, 4.7uF, 16V, X5R, 10%, 0603, T=0.8mm; Manufacturer_Part_Number: CC0603KRX5R7BB475; Manufacturer: YAGEO; Provided_By: SUBCO; ECCN_US: EAR99; ECCN_EU: NEC; Internal_Part_Number: MCD-00009; Status: Released; Part_Type: Capacitor; Package: C0603; ComponentLink1Description: Datasheet; ComponentLink1URL: http://tunmcdsvn.tun.st.com/Component_Datasheet_Library/Trunk/Capacitors/Yageo_Multilayer_capacitor_X5R_series_100pF_to_100uF
CN1 = MCD-00028: USB-MICRO-B, 0.65mm, RA, SMT, Bottom Mount,; Manufacturer_Part_Number: 1050170001; Manufacturer: MOLEX; Part_Type: Connector; Provided_By: SUBCO; Internal_Part_Number: MCD-00028; Status: Released; ComponentLink1Description: Datasheet; ComponentLink1URL: http://tunmcdsvn.tun.st.com/Component_Datasheet_Library/Trunk/Connectors/Molex_Connector-USB-microB_105017-0001; ECCN_US: n/a; ECCN_EU: n/a
CN2 = MCD-00029: Header, 4x1, 2,54mm, VR, TH, Height 5.84mm/2.54mm; Manufacturer_Part_Number: TSW-104-07-x-S; Manufacturer: SAMTEC; Part_Type: Connector; Provided_By: SUBCO; Internal_Part_Number: MCD-00029; Value: Header 4x1; Status: Released; ComponentLink1Description: Datasheet; ComponentLink1URL: http://tunmcdsvn.tun.st.com/Component_Datasheet_Library/Trunk/Connectors/Samtec_TSW-HTSW-series; ECCN_US: n/a; ECCN_EU: n/a
CN3 CN4 = MCD-00214: Header, 2x1, 2,54mm, VR, TH, Height 5.84mm/10.16mm; Part_Type: Connector; Manufacturer_Part_Number: TSW-102-09-x-S; Manufacturer: SAMTEC; Provided_By: SUBCO; Internal_Part_Number: MCD-00214; Status: Released; ComponentLink1Description: Datasheet; ComponentLink1URL: http://tunmcdsvn.tun.st.com/Component_Datasheet_Library/Trunk/Connectors/Samtec_TSW-HTSW-series; ECCN_US: n/a; ECCN_EU: n/a
CN5 = MCD-01226: Header 5x2, 1.27mm, Dual row, Straight, Surface mount, vertical male connector. 3.05mm lead. Mates with FFSD connector. Footprint compatible with FTSH-107-01-L-DV,-K,-A,-P,-ES (STDC14 MEDIUM); Manufacturer_Part_Number: FTSH-105-01-L-DV-K; Manufacturer: SAMTEC; Alternate_Manufacturer_Part_Number: P127B-2x05MGF-079-1A; Alternate_Manufacturer: JIUBABA; Provided_By: SUBCO; Internal_Part_Number: MCD-01226; Status: Released; Part_Type: Connector; ComponentLink1Description: Datasheet; ComponentLink1URL: http://tunmcdsvn.tun.st.com/Component_Datasheet_Library/Trunk/Connectors/Samtec_FTSH_smt_series; ECCN_US: n/a; ECCN_EU: n/a
D1-D3 = MCD-00034: Manufacturer: STMICROELECTRONICS; Part_Type: Diode; BMS_Part_Number: 9151097; Provided_By: SUBCO with ST control; ECCN_US: EAR99; ECCN_EU: NEC; Internal_Part_Number: MCD-00034; Value: BAT60JFILM; Manufacturer_Part_Number: BAT60JFILM; ComponentLink1Description: Datasheet; Status: Released; ComponentLink1URL: http://tunmcdsvn.tun.st.com/Component_Datasheet_Library/Trunk/Diodes/STM_Diode_BAT60JFILM-SOD323
HW6-HW8 = MCD-00043: SHUNT 2.54mm BLACK; Manufacturer_Part_Number: SNT-100-BK-G; Manufacturer: SAMTEC; Part_Type: Mechanical; Alternate_Manufacturer_Part_Number: 316102S111A; Alternate_Manufacturer: JIUBABA; Provided_By: SUBCO; Internal_Part_Number: MCD-00043; ComponentLink1Description: Datasheet; Status: Released; ComponentLink1URL: http://tunmcdsvn.tun.st.com/Component_Datasheet_Library/Trunk/Connectors/Samtec_Shunt_Jumper_SNT100; ECCN_US: n/a; ECCN_EU: n/a
JP1 = MCD-00045: Header, 2x1, 2,54mm, VR, TH, Height 5.84mm/2.54mm; Part_Type: Connector; Manufacturer_Part_Number: TSW-102-07-x-S; Manufacturer: SAMTEC; Alternate_Manufacturer_Part_Number: 313102S111116;313102S111116; Alternate_Manufacturer: JIUBABA; LIANYI; Provided_By: SUBCO; Internal_Part_Number: MCD-00045; Status: Released; ComponentLink1Description: Datasheet; ComponentLink1URL: http://tunmcdsvn.tun.st.com/Component_Datasheet_Library/Trunk/Connectors/Samtec_TSW-HTSW-series; ECCN_US: n/a; ECCN_EU: n/a
JP3 = MCD-00683: Header, 2x1, 2,54mm, VR, TH, Height 5.84mm/2.54mm - Shunt Fitted by default; Part_Type: Connector; Manufacturer_Part_Number: TSW-102-07-x-S; Manufacturer: SAMTEC; Alternate_Manufacturer_Part_Number: 313102S111116; Alternate_Manufacturer: LIANYI; Provided_By: SUBCO; Internal_Part_Number: MCD-00683; Status: Released; ComponentLink1Description: Datasheet; ComponentLink1URL: http://tunmcdsvn.tun.st.com/Component_Datasheet_Library/Trunk/Connectors/Samtec_TSW-HTSW-series; ECCN_US: n/a; ECCN_EU: n/a
LD4 = MCD-00051: LED Bicolor; Part_Type: Display; Manufacturer_Part_Number: HSMF-A201-A00J1; Manufacturer: AVAGO TECHNOLOGIES; Alternate_Manufacturer_Part_Number: LE-RGW35280; Alternate_Manufacturer: EVERLUCK; Provided_By: SUBCO; ECCN_US: EAR99; ECCN_EU: NEC; Internal_Part_Number: MCD-00051; Value: LD_BICOLOR_CMS; Status: Released; ComponentLink1Description: Datasheet; ComponentLink1URL: http://tunmcdsvn.tun.st.com/Component_Datasheet_Library/Trunk/Display/Avago_LED-SMC_HSMx-A2xx-02Feb2012
LD6 = MCD-00049: LED, Red, 0603; Manufacturer_Part_Number: 19-213-R6C-AP1Q2B/3T; Manufacturer: EVERLIGHT; Part_Type: Display; Provided_By: SUBCO; ECCN_US: EAR99; ECCN_EU: NEC; Internal_Part_Number: MCD-00049; ComponentLink1Description: Datasheet; Status: Released; ComponentLink1URL: http://tunmcdsvn.tun.st.com/Component_Datasheet_Library/Trunk/Display/Everlight_SMD-LED-RED_19-213-R6C-AP1Q2B-3T-V3.doc; Package: LED 0603
R1 R4 = MCD-00223: Resistor,100K,0603,1%,1/10W; Manufacturer_Part_Number: RC0603FR-07100KL; Manufacturer: YAGEO; Provided_By: SUBCO; ECCN_US: EAR99; ECCN_EU: NEC; Internal_Part_Number: MCD-00223; Status: Released; Part_Type: Resistor; Package: R0603; ComponentLink1Description: Datasheet; ComponentLink1URL: http://tunmcdsvn.tun.st.com/Component_Datasheet_Library/Trunk/Resistors/Yageo_Resistor_RC0603-series
R2 = MCD-00070: Resistor,1K,0603,1%,1/10W; Manufacturer_Part_Number: RC0603FR-071KL; Manufacturer: YAGEO; Provided_By: SUBCO; ECCN_US: EAR99; ECCN_EU: NEC; Internal_Part_Number: MCD-00070; ComponentLink1Description: Datasheet; Status: Released; Part_Type: Resistor; Package: R0603; ComponentLink1URL: http://tunmcdsvn.tun.st.com/Component_Datasheet_Library/Trunk/Resistors/Yageo_Resistor_RC0603-series
R3 R10 R11 R13 R23 R29 = MCD-00481: Resistor,47R,0402,1%,1/16W; Manufacturer_Part_Number: RC0402FR-0747RL; Manufacturer: YAGEO; Provided_By: SUBCO; ECCN_US: EAR99; ECCN_EU: NEC; Internal_Part_Number: MCD-00481; Status: Released; Part_Type: Resistor; Package: R0402; ComponentLink1Description: Datasheet; ComponentLink1URL: http://tunmcdsvn.tun.st.com/Component_Datasheet_Library/Trunk/Resistors/Yageo_Resistor_RC0402-series
R5 R17 R21 R70 = MCD-00119: Resistor,100R,0402,1%,1/16W; Manufacturer_Part_Number: RC0402FR-07100RL; Manufacturer: YAGEO; Provided_By: SUBCO; ECCN_US: EAR99; ECCN_EU: NEC; Internal_Part_Number: MCD-00119; Status: Released; Part_Type: Resistor; ComponentLink1Description: Datasheet; Package: R0402; ComponentLink1URL: http://tunmcdsvn.tun.st.com/Component_Datasheet_Library/Trunk/Resistors/Yageo_Resistor_RC0402-series
R6 = MCD-00185: Resistor,3K,0402,1%,1/16W; Manufacturer_Part_Number: RC0402FR-073KL; Manufacturer: YAGEO; Provided_By: SUBCO; ECCN_US: EAR99; ECCN_EU: NEC; Internal_Part_Number: MCD-00185; Status: Released; ComponentLink1Description: Datasheet; Part_Type: Resistor; Package: R0402; ComponentLink1URL: http://tunmcdsvn.tun.st.com/Component_Datasheet_Library/Trunk/Resistors/Yageo_Resistor_RC0402-series
R7 = MCD-00220: Resistor,10K,0603,1%,1/10W; Manufacturer_Part_Number: RC0603FR-0710KL; Manufacturer: YAGEO; Provided_By: SUBCO; ECCN_US: EAR99; ECCN_EU: NEC; Internal_Part_Number: MCD-00220; ComponentLink1Description: Datasheet; Status: Released; Part_Type: Resistor; Package: R0603; ComponentLink1URL: http://tunmcdsvn.tun.st.com/Component_Datasheet_Library/Trunk/Resistors/Yageo_Resistor_RC0603-series
R8 R9 = MCD-00197: Resistor,330R,0603,1%,1/10W; Manufacturer_Part_Number: RC0603FR-07330RL; Manufacturer: YAGEO; BMS_Part_Number: 9129729; Provided_By: SUBCO; ECCN_US: EAR99; ECCN_EU: NEC; Internal_Part_Number: MCD-00197; Status: Released; ComponentLink1Description: Datasheet; Part_Type: Resistor; Package: R0603; ComponentLink1URL: http://tunmcdsvn.tun.st.com/Component_Datasheet_Library/Trunk/Resistors/Yageo_Resistor_RC0603-series
R14 R18 R20 = MCD-00065: Resistor,4K7,0402,1%,1/16W; Manufacturer_Part_Number: RC0402FR-074K7L; Manufacturer: YAGEO; Alternate_Manufacturer_Part_Number: RT0402FRE074K7L; Provided_By: SUBCO; ECCN_US: EAR99; ECCN_EU: NEC; Internal_Part_Number: MCD-00065; Status: Released; ComponentLink1Description: Datasheet; Alternate_Manufacturer: YAGEO; Part_Type: Resistor; Package: R0402; ComponentLink1URL: http://tunmcdsvn.tun.st.com/Component_Datasheet_Library/Trunk/Resistors/Yageo_Resistor_RC0402-series
R15 = MCD-00055: Resistor,2K7,0402,1%,1/16W; Manufacturer_Part_Number: RC0402FR-072K7L; Manufacturer: YAGEO; Provided_By: SUBCO; ECCN_US: EAR99; ECCN_EU: NEC; Internal_Part_Number: MCD-00055; Status: Released; ComponentLink1Description: Datasheet; Part_Type: Resistor; Package: R0402; ComponentLink1URL: http://tunmcdsvn.tun.st.com/Component_Datasheet_Library/Trunk/Resistors/Yageo_Resistor_RC0402-series
R22 R24 = MCD-00053: as R43 on sheet Ethernet; Internal_Part_Number: MCD-00053; Status: Released; ComponentLink1Description: Datasheet; Part_Type: Resistor; Package: R0402; ComponentLink1URL: http://tunmcdsvn.tun.st.com/Component_Datasheet_Library/Trunk/Resistors/Yageo_Resistor_RC0402-series
SB5 SB13 = MCD-00071: as SB98 on sheet Ethernet; Internal_Part_Number: MCD-00071; Status: Released; ComponentLink1Description: Datasheet; Package: SB0603; ComponentLink1URL: http://tunmcdsvn.tun.st.com/Component_Datasheet_Library/Trunk/Resistors/Yageo_Resistor_RC0603-series; ECCN_US: n/a; ECCN_EU: n/a
U1 U10 = MCD-00264: Dual bit dual supply bus transceiver; Part_Type: IC; Manufacturer: TEXAS INSTRUMENTS; Provided_By: SUBCO; ECCN_US: EAR99; ECCN_EU: NEC; Internal_Part_Number: MCD-00264; Value: SN74LVC2T45DCUT; Status: Released; Manufacturer_Part_Number: SN74LVC2T45DCUT; ComponentLink1Description: Datasheet; ComponentLink1URL: http://tunmcdsvn.tun.st.com/Component_Datasheet_Library/Trunk/IC/TI_Dual_bit_tranceiver_SN74LVC2T45
U2 = MCD-00159: 500mA, Enhanced single channel power switches with active high enable pin; Part_Type: IC; Manufacturer: STMICROELECTRONICS; Alternate_Manufacturer_Part_Number: TPS2051C; Alternate_Manufacturer: TEXAS INSTRUMENTS; BMS_Part_Number: 9159009; Provided_By: SUBCO with ST control; ECCN_US: EAR99; ECCN_EU: NEC; Internal_Part_Number: MCD-00159; Value: STMPS2151STR; Status: Released; Manufacturer_Part_Number: STMPS2151STR; ComponentLink1Description: Datasheet; ComponentLink1URL: http://tunmcdsvn.tun.st.com/Component_Datasheet_Library/Trunk/IC/STM_PWR-Switch_STMPS2151STR
U3 U4 = MCD-00170: ESD protection 6V1; Part_Type: Diode; Manufacturer: STMICROELECTRONICS; BMS_Part_Number: 9151132; Provided_By: SUBCO with ST control; ECCN_US: EAR99; ECCN_EU: NEC; Internal_Part_Number: MCD-00170; Status: Released; Manufacturer_Part_Number: ESDALC6V1-1U2; ComponentLink1Description: Datasheet; ComponentLink1URL: http://tunmcdsvn.tun.st.com/Component_Datasheet_Library/Trunk/Diodes/STM_ESD_ESDALC6V1-1U2
U5 = MCD-00649: Common mode filter with ESD protection for USB 2.0 interface; Part_Type: Diode; Manufacturer: STMICROELECTRONICS; BMS_Part_Number: 9151138; Provided_By: SUBCO with ST control; ECCN_US: EAR99; ECCN_EU: NEC; Internal_Part_Number: MCD-00649; Value: ECMF02-2AMX6; Status: Released; Manufacturer_Part_Number: ECMF02-2AMX6; ComponentLink1Description: Datasheet; ComponentLink1URL: http://tunmcdsvn.tun.st.com/Component_Datasheet_Library/Trunk/Diodes/STM_ESD_ECMF02-2AMX6
U6 = MCD-00251: High power transient voltage suppressor, 7V breakdown; Part_Type: Diode; Manufacturer: STMICROELECTRONICS; BMS_Part_Number: 9179042; Provided_By: SUBCO with ST control; ECCN_US: EAR99; ECCN_EU: NEC; Internal_Part_Number: MCD-00251; Status: Released; Manufacturer_Part_Number: ESDA7P60-1U1M; ComponentLink1Description: Datasheet; ComponentLink1URL: http://tunmcdsvn.tun.st.com/Component_Datasheet_Library/Trunk/Diodes/STM_ESD_ESDA7P60-1U1M
U7 = MCD-00596: STM32F723IEK  (STM32F7) BGA176; Part_Type: IC; Manufacturer_Part_Number: STM32F723IEK6; Manufacturer: STMICROELECTRONICS; BMS_Part_Number: 9175300; Provided_By: SUBCO with ST control; ECCN_US: 3A991A2; ECCN_EU: NEC; Internal_Part_Number: MCD-00596; Value: ST-LINKV3E_SWD; Status: Released; ComponentLink1Description: Datasheet; ComponentLink1URL: http://tunmcdsvn.tun.st.com/Component_Datasheet_Library/Trunk/IC/BGA176+25L_10x10x0.6_pitch0.65
U8 U24 = MCD-00136: Dual Transil array for ESD protection; Part_Type: Diode; Manufacturer: STMICROELECTRONICS; BMS_Part_Number: 9151112; Provided_By: SUBCO with ST control; ECCN_US: EAR99; ECCN_EU: NEC; Internal_Part_Number: MCD-00136; Value: ESDALC6V1W5; Status: Released; Manufacturer_Part_Number: ESDALC6V1W5; ComponentLink1Description: Datasheet; ComponentLink1URL: http://tunmcdsvn.tun.st.com/Component_Datasheet_Library/Trunk/Diodes/STM_ESD_ESDALC6V1W5
U9 = MCD-00086: Ultra low drop-low noise BiCMOS voltage, regulators low ESR capacitors compatible; Manufacturer: STMICROELECTRONICS; Part_Type: IC; BMS_Part_Number: 9176161; Provided_By: SUBCO with ST control; ECCN_US: EAR99; ECCN_EU: NEC; Internal_Part_Number: MCD-00086; Value: LD3985M33R; Status: Released; Manufacturer_Part_Number: LD3985M33R; ComponentLink1Description: Datasheet; ComponentLink1URL: http://tunmcdsvn.tun.st.com/Component_Datasheet_Library/Trunk/IC/STM_LDO_LD3985
X1 = MCD-00597: Oscillator 25Mhz, +-50ppm, Vcc:3.3V typ, square wave: [0.1Vcc;0.9Vcc], Enable pin, SMD; Manufacturer_Part_Number: NZ2520SH 25MHz END4869C; Manufacturer: NDK; Alternate_Manufacturer_Part_Number: NZ2520SB 25MHz END4869B; Part_Type: Crystal_Osc; BMS_Part_Number: 9157050; Provided_By: SUBCO; ECCN_US: EAR99; ECCN_EU: NEC; Internal_Part_Number: MCD-00597; Status: Released; Alternate_Manufacturer: NDK; ComponentLink1Description: Datasheet; ComponentLink1URL: http://tunmcdsvn.tun.st.com/Component_Datasheet_Library/Trunk/Crystal_Osc/NDK_NZ2520SH 25MHz END4869C